# Altium project Контроллер табло изм.2.PrjPcb
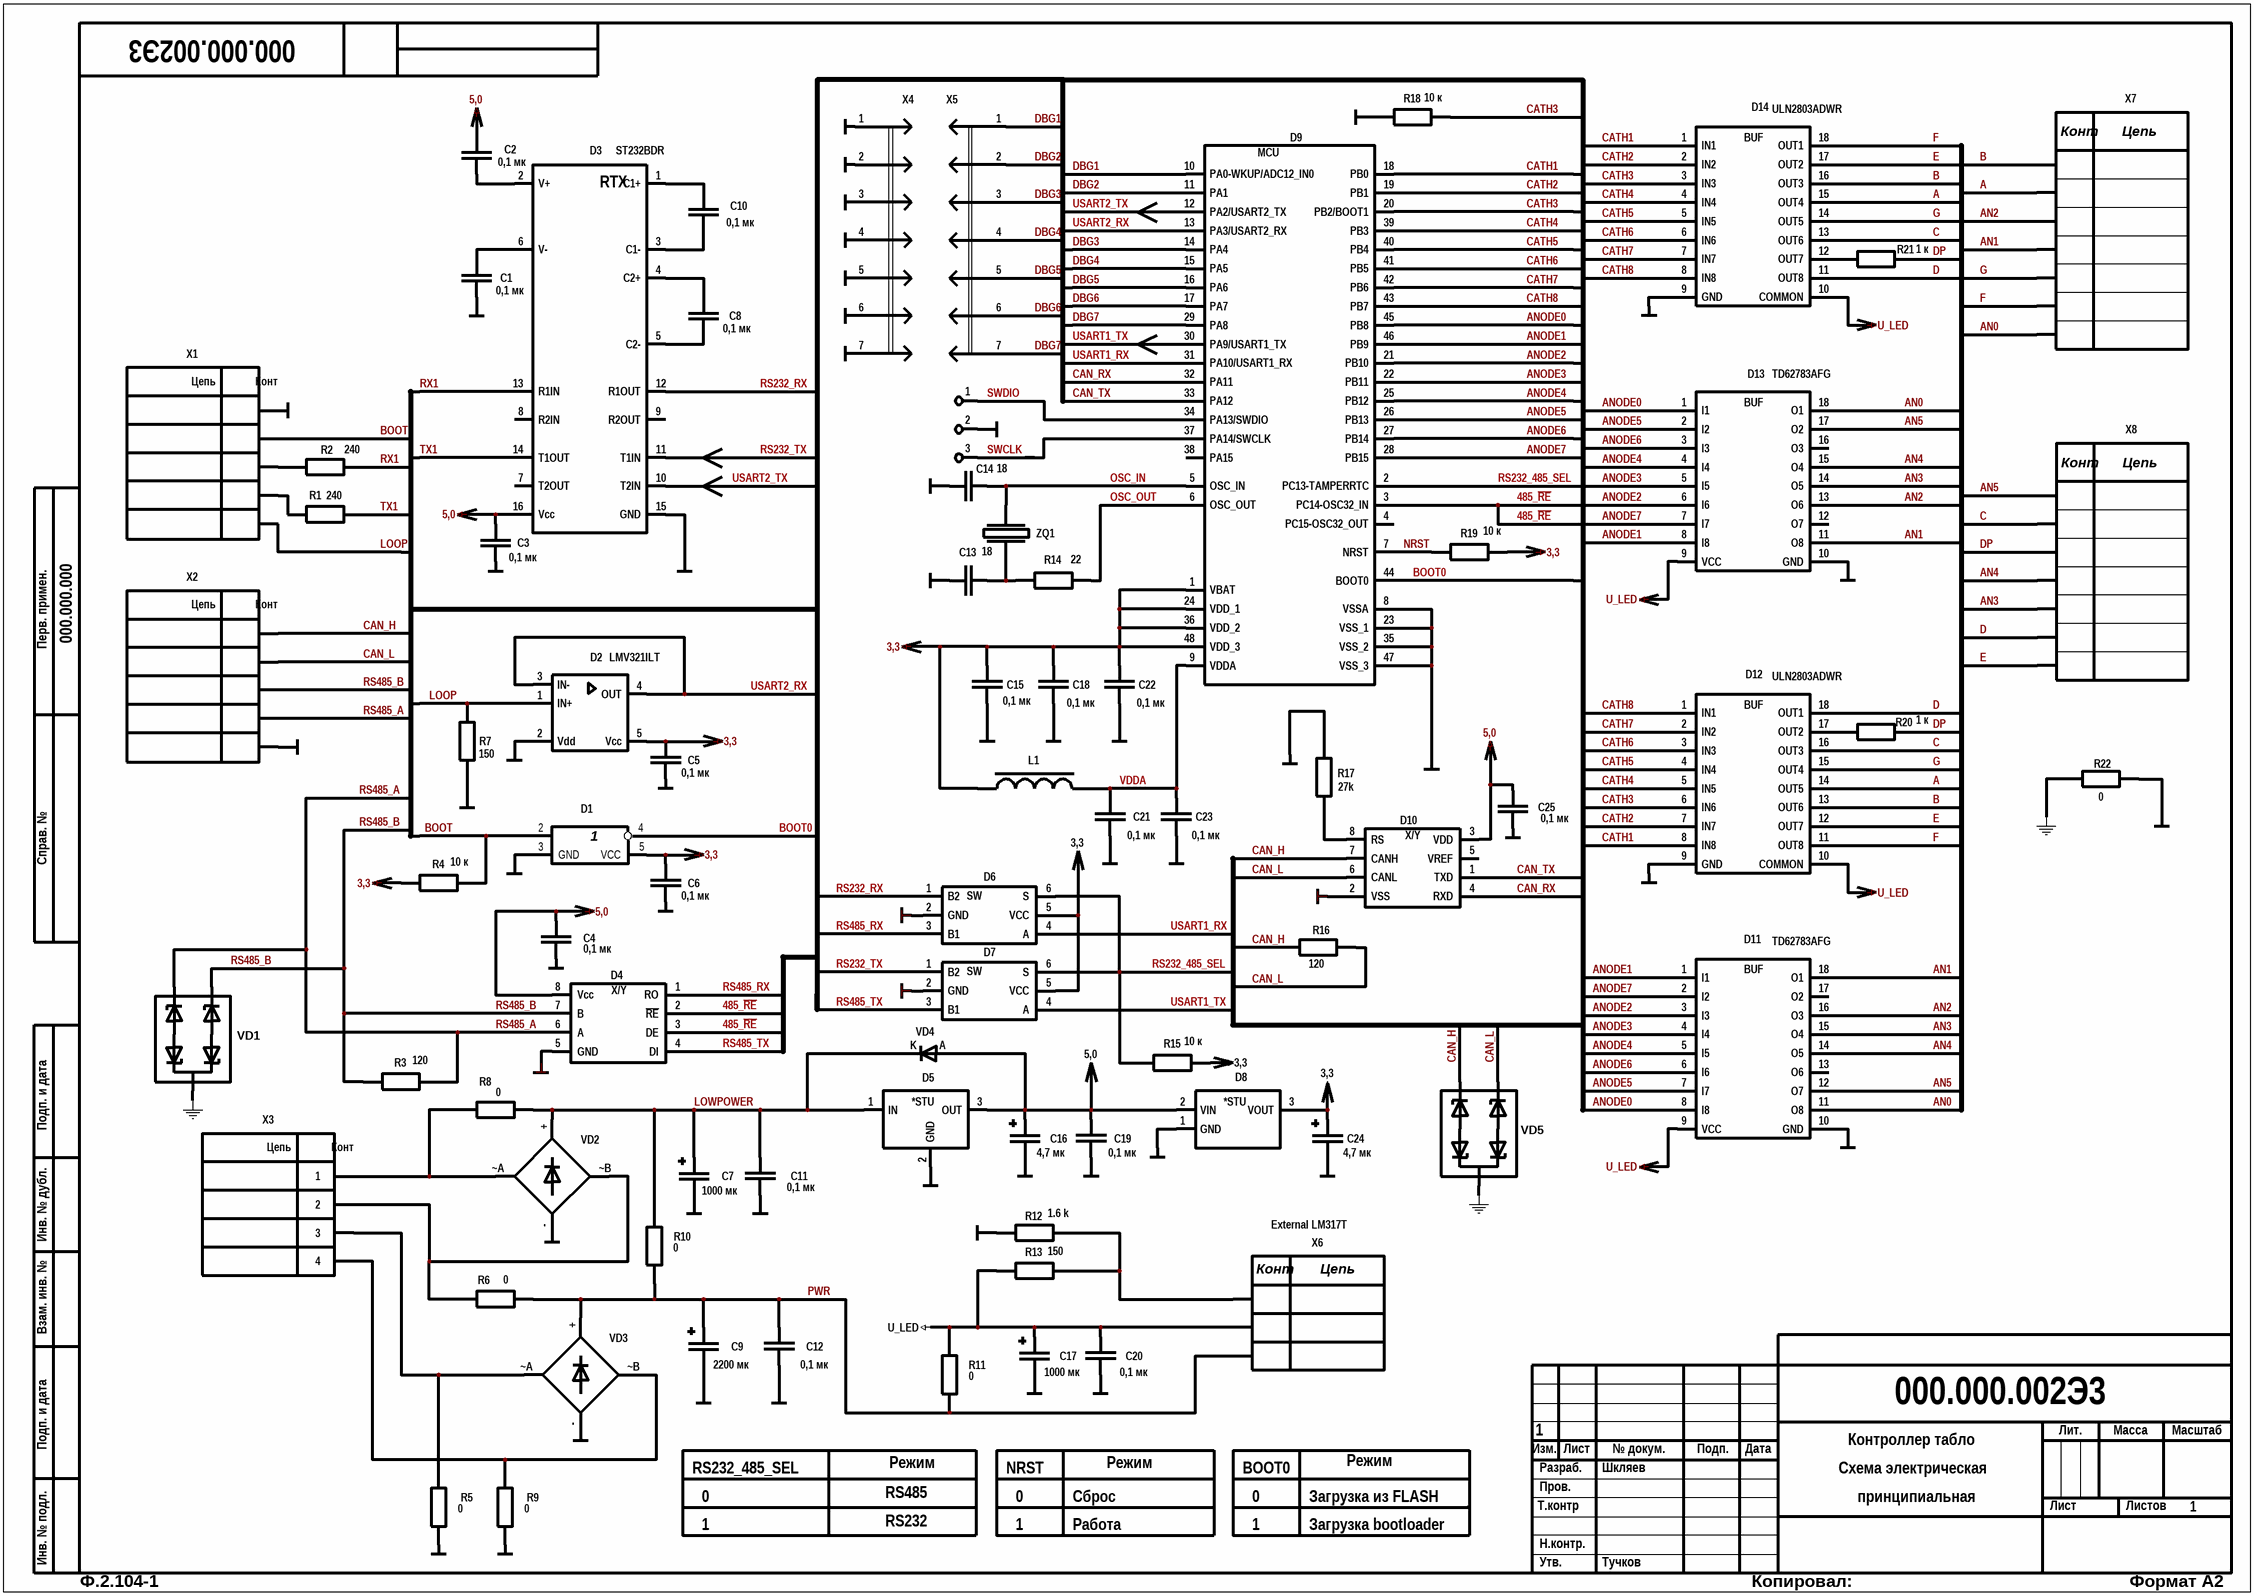
[diagram p0: 000.000.002Э3 Контроллер табло.SchDoc]
1 sheet, 155 parts. Net scope: global (net labels, ports and power ports of the same name join across sheets).
Board file: 000.000.002 rev.1.PcbDoc

## Sheet 000.000.002Э3 Контроллер табло.SchDoc
size 594 x 420 mm; Zam._gl._konstr._po_konctr._chasti: {Фамилия}; Zakaz: {Заказ}; Zam._gl._konstr._po_shemnoi_chasti: {Инженер}; ApprovedBy: Тучков; DrawnBy: Шкляев; DocumentNumber: 000.000.002Э3; SheetTotal: 1; PageSetup: Record=PageOptions|CenterHorizontal=False|CenterVertical=False|PrintScale=0.33|XCorrection=0.00|YCorrection=0.00|PrintKind=1|BorderSize=5000000|LeftOffset=0|BottomOffset=0|Orientation=1|PaperLength=1000|PaperWidth=1000|Scale=100|PaperSource=15|PrintQuality=600|MediaType=1|DitherType=10|PaperKind=A4|PrintScaleMode=1; ImagePath: 000.000.000; Rule: PcbType=ProtelPcb

### Parts
(Parts that share a designator on the sheet are numbered #1, #2 ... from top to bottom, then left to right.)
1  (no value)  [PADROUND]  (no BOM)
2  (no value)  [PADROUND]  (no BOM)
3  (no value)  [PADROUND]  (no BOM)
*  Arrow signal  (value not drawn)  (graphical)
*?#1  (no value)  (graphical)
*?#2  GND  (value not drawn)  (graphical)
*?#3  GND  (value not drawn)  (graphical)
*?#4  GND  (value not drawn)  (graphical)
*?#5  GND  (value not drawn)  (graphical)
*?#6  Arrow signal  (value not drawn)  (graphical)
*?#7  GND  (value not drawn)  (graphical)
*?#8  GND  (value not drawn)  (graphical)
*?#9  GND  (value not drawn)  (graphical)
*?#10  GND  (value not drawn)  (graphical)
*?#11  GND  (value not drawn)  (graphical)
*?#12  (no value)  (graphical)
*?#13  Arrow signal  (value not drawn)  (graphical)
*?#14  GND  (value not drawn)  (graphical)
*?#15  GND  (value not drawn)  (graphical)
*?#16  GND  (value not drawn)  (graphical)
*?#17  Arrow signal  (value not drawn)  (graphical)
*?#18  GND  (value not drawn)  (graphical)
*?#19  (no value)  (graphical)
*?#20  (no value)  (graphical)
*?#21  GND  (value not drawn)  (graphical)
*?#22  GND  (value not drawn)  (graphical)
*?#23  GND  (value not drawn)  (graphical)
*?#24  GND  (value not drawn)  (graphical)
*?#25  (no value)  (graphical)
*?#26  (no value)  (graphical)
*?#27  GND  (value not drawn)  (graphical)
*?#28  GND  (value not drawn)  (graphical)
*?#29  GND  (value not drawn)  (graphical)
*?#30  (no value)  (graphical)
*?#31  (no value)  (graphical)
*?#32  GND  (value not drawn)  (graphical)
*?#33  GND  (value not drawn)  (graphical)
*?#34  GND  (value not drawn)  (graphical)
*?#35  GND  (value not drawn)  (graphical)
*?#36  GND  (value not drawn)  (graphical)
*?#37  GND  (value not drawn)  (graphical)
*?#38  GND  (value not drawn)  (graphical)
*?#39  GND  (value not drawn)  (graphical)
*?#40  (no value)  (graphical)
*?#41  (no value)  (graphical)
*?#42  GND  (value not drawn)  (graphical)
*?#43  GND  (value not drawn)  (graphical)
*?#44  GND  (value not drawn)  (graphical)
*?#45  GND  (value not drawn)  (graphical)
*?#46  (no value)  (graphical)
*?#47  (no value)  (graphical)
*?#48  GND  (value not drawn)  (graphical)
*?#49  GND  (value not drawn)  (graphical)
*?#50  (no value)  (graphical)
*?#51  GND  (value not drawn)  (graphical)
*?#52  GND  (value not drawn)  (graphical)
*?#53  GND  (value not drawn)  (graphical)
*?#54  GND  (value not drawn)  (graphical)
*?#55  (no value)  (graphical)
*?#56  (no value)  (graphical)
*?#57  (no value)  (graphical)
*?#58  GND  (value not drawn)  (graphical)
*?#59  GND  (value not drawn)  (graphical)
*?#60  GND  (value not drawn)  (graphical)
*?#61  GND  (value not drawn)  (graphical)
*?#62  GND  (value not drawn)  (graphical)
*?#63  (no value)  (graphical)
*?#64  GND  (value not drawn)  (graphical)
*?#65  GND  (value not drawn)  (graphical)
*?#66  GND  (value not drawn)  (graphical)
*?#67  GND  (value not drawn)  (graphical)
*?#68  GND  (value not drawn)  (graphical)
*?#69  GND  (value not drawn)  (graphical)
*?#70  GND  (value not drawn)  (graphical)
*?#71  GND  (value not drawn)  (graphical)
*?#72  GND  (value not drawn)  (graphical)
*?#73  GND  (value not drawn)  (graphical)
*?#74  GND  (value not drawn)  (graphical)
*?#75  GND  (value not drawn)  (graphical)
C1  Visible: 0,1 мк  [CAP0805-125]  (hidden comment: GRM21BR71H104KA01L (0805 X7R 0,1 мкФ ±10% 50 В))
C2  Visible: 0,1 мк  [CAP0805-125]  (hidden comment: GRM21BR71H104KA01L (0805 X7R 0,1 мкФ ±10% 50 В))
C3  Visible: 0,1 мк  [CAP0805-125]  (hidden comment: GRM21BR71E105KA99L (0805 X7R 1 мкФ ±10% 25 В))
C4  Visible: 0,1 мк  [CAP0805-125]  (hidden comment: GRM21BR71E105KA99L (0805 X7R 1 мкФ ±10% 25 В))
C5  Visible: 0,1 мк  [CAP0805-125]  (hidden comment: GRM21BR71H104KA01L (0805 X7R 0,1 мкФ ±10% 50 В))
C6  Visible: 0,1 мк  [CAP0805-125]  (hidden comment: GRM21BR71H104KA01L (0805 X7R 0,1 мкФ ±10% 50 В))
C7  Visible: 1000 мк  [CAPR10x21]  (hidden comment: WLR102M1EG21 (1000 мкФ 25 В 10х21))
C8  Visible: 0,1 мк  [CAP0805-125]  (hidden comment: GRM21BR71H104KA01L (0805 X7R 0,1 мкФ ±10% 50 В))
C9  Visible: 2200 мк  [CAPR16x25]  (hidden comment: TKR222M1VK25 (2200 мкФ 35 В 16х25))
C10  Visible: 0,1 мк  [CAP0805-125]  (hidden comment: GRM21BR71H104KA01L (0805 X7R 0,1 мкФ ±10% 50 В))
C11  Visible: 0,1 мк  [JFA11x13x7.5]  (hidden comment: JFA02A104J (0,1 мкФ, 100 В, 5%))
C12  Visible: 0,1 мк  [JFA11x13x7.5]  (hidden comment: JFA02A104J (0,1 мкФ, 100 В, 5%))
C13  Visible: 18  [CAP0805-060_NP0]  (hidden comment: GRM2165C1H180JD01D (0805 NP0 18 пФ ±5% 50 В))
C14  Visible: 18  [CAP0805-060_NP0]  (hidden comment: GRM2165C1H180JD01D (0805 NP0 18 пФ ±5% 50 В))
C15  Visible: 0,1 мк  [CAP0805-125]  (hidden comment: GRM21BR71H104KA01L (0805 X7R 0,1 мкФ ±10% 50 В))
C16  Visible: 4,7 мк  [3216-18]  (hidden comment: TECAP4.7/10VA10 ( тип А 4,7 мкФ 10 В ±10%))
C17  Visible: 1000 мк  [CAPR10x21]  (hidden comment: WLR102M1EG21 (1000 мкФ 25 В 10х21))
C18  Visible: 0,1 мк  [CAP0805-125]  (hidden comment: GRM21BR71H104KA01L (0805 X7R 0,1 мкФ ±10% 50 В))
C19  Visible: 0,1 мк  [CAP0805-125]  (hidden comment: GRM21BR71H104KA01L (0805 X7R 0.1 мкФ ±10% 50 В))
C20  Visible: 0,1 мк  [JFA11x13x7.5]  (hidden comment: JFA02A104J (0,1 мкФ, 100 В, 5%))
C21  Visible: 0,1 мк  [CAP0805-125]  (hidden comment: GRM21BR71E105KA99L (0805 X7R 1 мкФ ±10% 25 В))
C22  Visible: 0,1 мк  [CAP0805-125]  (hidden comment: GRM21BR71H104KA01L (0805 X7R 0,1 мкФ ±10% 50 В))
C23  Visible: 0,1 мк  [CAP0805-125]  (hidden comment: GRM21BR71H104KA01L (0805 X7R 0,1 мкФ ±10% 50 В))
C24  Visible: 4,7 мк  [3216-18]  (hidden comment: TECAP4.7/10VA10 ( тип А 4,7 мкФ 10 В ±10%))
C25  Visible: 0,1 мк  [CAP0805-125]  (hidden comment: GRM21BR71E105KA99L (0805 X7R 1 мкФ ±10% 25 В))
D1  SN74AHC1G14DRLR  [SOT23-5AM]  (value not drawn)
D2  LMV321ILT  [SOT23-5]
D3  ST232BDR  [SO16_N]
D4  ST485ECDR  [SOIC8N_L]  (value not drawn)
D5  L78M05ABDT-TR  [D2PAK]  (value not drawn)
D6  SN74LVC1G3157DBVR  [SOT23-6]  (value not drawn)
D7  SN74LVC1G3157DBVR  [SOT23-6]  (value not drawn)
D8  MC78LC33NTRG  [SOT23-5]  (value not drawn)
D9  STM32F103C8T6  [LQFP-48]  (value not drawn)
D10  MCP2551-I/SN  [SOIC8N_L]  (value not drawn)
D11  TD62783AFG  [SOP-18]
D12  ULN2803ADWR  [SOP-18]
D13  TD62783AFG  [SOP-18]
D14  ULN2803ADWR  [SOP-18]
L1  LQM21PN4R7NGR (0805 4,7 мкГн 0,8 А 288 мОм)  [LQM21-G]  (value not drawn)
R1  Visible: 240  [RES0805-050]  (hidden comment: RC0805FR-07240RL (0805 240 Ом ±1%))
R2  Visible: 240  [RES0805-050]  (hidden comment: RC0805FR-07240RL (0805 240 Ом ±1%))
R3  Visible: 120  [RES0805-050]  (hidden comment: RC0805FR-07120RL (0805 120 Ом ±1%))
R4  Visible: 10 к  [RES0805-050]  (hidden comment: RC0805FR-0710KL (0805 10 кОм ±1%))
R5  Visible: 0  [RES2512-055]  (hidden comment: RC2512FR-070RL (1206 0 Ом))
R6  Visible: 0  [RES2512-055]  (hidden comment: RC2512FR-070RL (1206 0 Ом))
R7  Visible: 150  [RES0805-050]  (hidden comment: RC0805FR-07150RL (0805 150 Ом ±1%))
R8  Visible: 0  [RES2512-055]  (hidden comment: RC2512FR-070RL (1206 0 Ом))
R9  Visible: 0  [RES2512-055]  (hidden comment: RC2512FR-070RL (1206 0 Ом))
R10  Visible: 0  [RES2512-055]  (hidden comment: RC2512FR-070RL (1206 0 Ом))
R11  Visible: 0  [RES2512-055]  (hidden comment: RC2512FR-070RL (1206 0 Ом))
R12  Visible: 1.6 k  [RES0805-050]  (hidden comment: RC0805FR-071K6L (0805 1,6 кОм ±1))
R13  Visible: 150  [RES0805-050]  (hidden comment: RC0805FR-07150RL (0805 150 Ом ±1%))
R14  Visible: 22  [RES0805-050]  (hidden comment: RC0805JR-0722R (0805 22 Ом ±5%))
R15  Visible: 10 к  [RES0805-050]  (hidden comment: RC0805FR-0710KL (0805 10 кОм ±1%))
R16  Visible: 120  [RES0805-050]  (hidden comment: RC0805FR-07120RL (0805 120 Ом ±1%))
R17  Visible: 27k  [RES0805-050]  (hidden comment: RC0805FR-0727KL (0805 27 кОм ±1%))
R18  Visible: 10 к  [RES0805-050]  (hidden comment: RC0805FR-0710KL (0805 10 кОм ±1%))
R19  Visible: 10 к  [RES0805-050]  (hidden comment: RC0805FR-0710KL (0805 10 кОм ±1%))
R20  Visible: 1 к  [RES1206-055]  (hidden comment: RC1206FR-071KL (1206 1 кОм ±1%))
R21  Visible: 1 к  [RES1206-055]  (hidden comment: RC1206FR-071KL (1206 1 кОм ±1%))
R22  Visible: 0  [RES2512-055]  (hidden comment: RC2512FR-070RL (1206 0 Ом))
VD1  CDSOT23-SM712  [SOT23]  (value not drawn)
VD2  2W10G-E4/51  [2W10]  (value not drawn)
VD3  2W10G-E4/51  [2W10]  (value not drawn)
VD4  S1G  [DO-214AA]  (value not drawn)
VD5  PESD2CAN,215  [SOT23]  (value not drawn)
X1  DS1070-5MVV6 (WF-05)  [WF-05]  (value not drawn)
X2  DS1070-5MVV6 (WF-05)  [WF-05]  (value not drawn)
X3  DS1072-4MVT6 (PWL-4)  [PWL-4]  (value not drawn)
X4  Соединитель штыревой PLS-7  [PLS-2.54-7]  (value not drawn)
X5  Соединитель штыревой PLS-7  [PLS-2.54-7]  (value not drawn)
X6  Connector 3  [WF-03]  (value not drawn)
X7  (no value)  [WF-07]
X8  (no value)  [WF-07]
ZQ1  8.000MHzHC-49US  [KX-3H_spacer]  (value not drawn)

### Nets
3,3: C5.2 C6.2 C15.2 C18.2 C22.2 C24.1 D1.5(VCC) D2.5(Vcc) D6.5(VCC) D7.5(VCC) D8.3(VOUT) D9.1(VBAT) D9.24(VDD_1) D9.36(VDD_2) D9.48(VDD_3) L1.1 R4.1 R15.2 R19.2
5,0: C2.2 C3.2 C4.2 C16.1 C19.2 C25.2 D3.16(Vcc) D4.8(Vcc) D5.3(OUT) D8.2(VIN) D10.3(VDD) VD4.A
GND: 2.1 C1.1 C3.1 C4.1 C5.1 C6.1 C7.2 C9.2 C11.1 C12.1 C13.2 C14.2 C15.1 C16.2 C17.2 C18.1 C19.1 C20.1 C21.1 C22.1 C23.1 C24.2 C25.1 D1.3(GND) D2.2(Vdd) D3.15(GND) D4.5(GND) D5.2(GND) D6.2(GND) D7.2(GND) D8.1(GND) D9.8(VSSA) D9.23(VSS_1) D9.35(VSS_2) D9.47(VSS_3) D10.2(VSS) D11.10(GND) D12.9(GND) D13.10(GND) D14.9(GND) R5.1 R7.2 R9.1 R12.1 R17.1 R18.2 R22.1 VD2.- VD3.- X1.1 X2.5 X4.1 X4.2 X4.3 X4.4 X4.5 X4.6 X4.7
GND_E: R22.2 VD1.3 VD5.3
U_LED: C17.1 C20.2 D11.9(VCC) D12.10(COMMON) D13.9(VCC) D14.10(COMMON) R11.2 R13.1 X6.2
485_~{RE}: D4.2(~{RE}) D4.3(DE) D9.3(PC14-OSC32_IN)
A: D12.14(OUT5) D14.15(OUT4) X7.2
AN0: D11.11(O8) D13.18(O1) X7.7
AN1: D11.18(O1) D13.11(O8) X7.4
AN2: D11.16(O3) D13.13(O6) X7.3
AN3: D11.15(O4) D13.14(O5) X8.5
AN4: D11.14(O5) D13.15(O4) X8.4
AN5: D11.12(O7) D13.17(O2) X8.1
ANODE0: D9.45(PB8) D11.8(I8) D13.1(I1)
ANODE1: D9.46(PB9) D11.1(I1) D13.8(I8)
ANODE2: D9.21(PB10) D11.3(I3) D13.6(I6)
ANODE3: D9.22(PB11) D11.4(I4) D13.5(I5)
ANODE4: D9.25(PB12) D11.5(I5) D13.4(I4)
ANODE5: D9.26(PB13) D11.7(I7) D13.2(I2)
ANODE6: D9.27(PB14) D11.6(I6) D13.3(I3)
ANODE7: D9.28(PB15) D11.2(I2) D13.7(I7)
B: D12.13(OUT6) D14.16(OUT3) X7.1
BOOT: D1.2 R4.2 X1.2
BOOT0: D1.4 D9.44(BOOT0)
C: D12.16(OUT3) D14.13(OUT6) X8.2
CAN_H: D10.7(CANH) R16.2 VD5.2 X2.1
CAN_L: D10.6(CANL) R16.1 VD5.1 X2.2
CAN_RX: D9.32(PA11) D10.4(RXD)
CAN_TX: D9.33(PA12) D10.1(TXD)
CATH1: D9.18(PB0) D12.8(IN8) D14.1(IN1)
CATH2: D9.19(PB1) D12.7(IN7) D14.2(IN2)
CATH3: D9.20(PB2/BOOT1) D12.6(IN6) D14.3(IN3) R18.1
CATH4: D9.39(PB3) D12.5(IN5) D14.4(IN4)
CATH5: D9.40(PB4) D12.4(IN4) D14.5(IN5)
CATH6: D9.41(PB5) D12.3(IN3) D14.6(IN6)
CATH7: D9.42(PB6) D12.2(IN2) D14.7(IN7)
CATH8: D9.43(PB7) D12.1(IN1) D14.8(IN8)
D: D12.18(OUT1) D14.11(OUT8) X8.6
DBG1: D9.10(PA0-WKUP/ADC12_IN0) X5.1
DBG2: D9.11(PA1) X5.2
DBG3: D9.14(PA4) X5.3
DBG4: D9.15(PA5) X5.4
DBG5: D9.16(PA6) X5.5
DBG6: D9.17(PA7) X5.6
DBG7: D9.29(PA8) X5.7
DP: R20.2 R21.2 X8.3
E: D12.12(OUT7) D14.17(OUT2) X8.7
F: D12.11(OUT8) D14.18(OUT1) X7.6
G: D12.15(OUT4) D14.14(OUT5) X7.5
LOOP: D2.1(IN+) R7.1 X1.5
LOWPOWER: C7.1 C11.2 D5.1(IN) R8.1 R10.2 VD2.+ VD4.K
NRST: D9.7(NRST) R19.1
OSC_IN: C14.1 D9.5(OSC_IN) ZQ1.1
OSC_OUT: D9.6(OSC_OUT) R14.1
PWR: C9.1 C12.2 R6.1 R10.1 R11.1 VD3.+ X6.3
RS232_485_SEL: D6.6(S) D7.6(S) D9.2(PC13-TAMPERRTC) R15.1
RS232_RX: D3.12(R1OUT) D6.1(B2)
RS232_TX: D3.11(T1IN) D7.1(B2)
RS485_A: D4.6(A) R3.2 VD1.2 X2.4
RS485_B: D4.7(B) R3.1 VD1.1 X2.3
RS485_RX: D4.1(RO) D6.3(B1)
RS485_TX: D4.4(DI) D7.3(B1)
RX1: D3.13(R1IN) R2.2
SWCLK: 3.1 D9.37(PA14/SWCLK)
SWDIO: 1.1 D9.34(PA13/SWDIO)
TX1: D3.14(T1OUT) R1.2
USART1_RX: D6.4(A) D9.31(PA10/USART1_RX)
USART1_TX: D7.4(A) D9.30(PA9/USART1_TX)
USART2_RX: D2.3(IN-) D2.4(OUT) D9.13(PA3/USART2_RX)
USART2_TX: D3.10(T2IN) D9.12(PA2/USART2_TX)
VDDA: C21.2 C23.2 D9.9(VDDA) L1.2
NetC1_2: C1.2 D3.6(V-)
NetC2_1: C2.1 D3.2(V+)
NetC8_1: C8.1 D3.5(C2-)
NetC8_2: C8.2 D3.4(C2+)
NetC10_1: C10.1 D3.3(C1-)
NetC10_2: C10.2 D3.1(C1+)
NetC13_1: C13.1 R14.2 ZQ1.2
NetD10_8: D10.8(RS) R17.2
NetD12_17: D12.17(OUT2) R20.1
NetD14_12: D14.12(OUT7) R21.1
NetR1_1: R1.1 X1.4
NetR2_1: R2.1 X1.3
NetR5_2: R5.2 VD3.~A X3.3
NetR6_2: R6.2 VD2.~B X3.2
NetR8_2: R8.2 VD2.~A X3.1
NetR9_2: R9.2 VD3.~B X3.4
NetR12_2: R12.2 R13.2 X6.1

Not connected (* = marked no-connect by the designer): D3 7(T2OUT) 8(R2IN) 9(R2OUT); D9 4(PC15-OSC32_OUT) 38(PA15); D10 5(VREF); D11 13(O6) 17(O2); D13 12(O7) 16(O3)

### Notes on the sheet
- External LM317T
- Режим
- 1
- Контроллер табло
- RS232_485_SEL
- 0
- RS485
- NRST
- Сброс
- BOOT0
- Загрузка из FLASH
- Схема электрическая
- принципиальная
- RS232
- Работа
- Загрузка bootloader
- Перв. примен.
- Справ. №
- Подп. и дата
- Инв. № дубл.
- Взам. инв. №
- Изм.
- Лист
- № докум.
- Подп.
- Дата
- Лит.
- Масса
- Масштаб
- Т.контр
- Пров.
- Разраб.
- Листов
- Инв. № подл.
- Н.контр.
- Ф.2.104-1
- Утв.
- Копировал:
- Формат А2
- (in symbol Connector 3) Конт; Цепь
- (in symbol Connector 4) Цепь; Конт
- (in symbol Connector 5) Цепь; Конт
- (in symbol Connector_7) Конт; Цепь
- (in symbol LM7805CV) *STU
- (in symbol MC78LC00) *STU
- (in symbol MCP2551-I/SN) X/Y
- (in symbol SN74AHC1G14DRLR) 1
- (in symbol SN74LVC1G3157DBVR) SW
- (in symbol ST232BDR) RTX
- (in symbol ST485ECDR) X/Y
- (in symbol STM32F103C8T6) MCU
- (in symbol ULN2803) BUF
- (in symbol UTC62783) BUF

### Library data of the parts
1-3 = Point
*?#1 *?#12 *?#19 *?#20 *?#25 *?#26 *?#30 *?#31 *?#40 *?#41 *?#46 *?#47 *?#50 *?#55-*?#57 *?#63 = Arrow power
C1-C6 C8 C10-C15 C18-C23 C25 = Capacitor
  C1 C2 C5 C6 C8 C10 C15 C18 C22 C23: Value: GRM21BR71H104KA01L (0805 X7R 0,1 мкФ ±10% 50 В); Cost: 7
  C3 C4 C21 C25: Value: GRM21BR71E105KA99L (0805 X7R 1 мкФ ±10% 25 В); Cost: 7
  C11 C12 C20: Value: JFA02A104J (0,1 мкФ, 100 В, 5%); Cost: 6
  C13 C14: Value: GRM2165C1H180JD01D (0805 NP0 18 пФ ±5% 50 В); Cost: 6
  C19: Value: GRM21BR71H104KA01L (0805 X7R 0.1 мкФ ±10% 50 В); Cost: 7
C7 C9 C16 C17 C24 = CAP_POL
  C7 C17: Value: WLR102M1EG21 (1000 мкФ 25 В 10х21); Cost: 16
  C9: Value: TKR222M1VK25 (2200 мкФ 35 В 16х25); Cost: 40
  C16 C24: Value: TECAP4.7/10VA10 ( тип А 4,7 мкФ 10 В ±10%); Cost: 8
D4 = ST485ECDR: RS485 приемопередатчик; Value: ST485ECDR
D5 = LM7805CV: Value: L78M05ABDT-TR; Cost: 15
D6 D7 = SN74LVC1G3157DBVR: Аналоговый переключатель, двухпозиционный; Value: SN74LVC1G3157DBVR
D8 = MC78LC00: Value: MC78LC33NTRG
D10 = MCP2551-I/SN: CAN приемопередатчик; Value: MCP2551-I/SN
D11 D13 = UTC62783: Value: TD62783AFG; Cost: 47
D12 D14 = ULN2803: Value: ULN2803ADWR; Cost: 55
L1 = L: Value: LQM21PN4R7NGR (0805 4,7 мкГн 0,8 А 288 мОм); Cost: 14; Visible: 4,7 мкГн
R1-R22 = Resistor
  R1 R2: Value: RC0805FR-07240RL (0805 240 Ом ±1%); Cost: 0.9
  R3 R16: Value: RC0805FR-07120RL (0805 120 Ом ±1%); Cost: 0.9
  R4 R15 R18 R19: Value: RC0805FR-0710KL (0805 10 кОм ±1%); Cost: 0.9
  R5 R6 R8-R11 R22: Value: RC2512FR-070RL (1206 0 Ом); Cost: 0,9
  R7 R13: Value: RC0805FR-07150RL (0805 150 Ом ±1%); Cost: 0.9
  R12: Value: RC0805FR-071K6L (0805 1,6 кОм ±1); Cost: 0,9
  R14: Value: RC0805JR-0722R (0805 22 Ом ±5%); Cost: 0.9
  R17: Value: RC0805FR-0727KL (0805 27 кОм ±1%); Cost: 0.9
  R20 R21: Value: RC1206FR-071KL (1206 1 кОм ±1%); Cost: 0.8
VD1 = CDSOT23-SM712: ESD for RS485; Value: CDSOT23-SM712
VD2 VD3 = Diode bridge: Diode; Value: 2W10G-E4/51; Cost: 27
VD4 = Diode: Value: S1G; Cost: 3
VD5 = PESD2CAN,215: Diode zener; Value: PESD2CAN,215
X1 X2 = Connector 5: Value: DS1070-5MVV6 (WF-05); Cost: 6
X3 = Connector 4: Value: DS1072-4MVT6 (PWL-4); Cost: 6; Visible: *
X4 X5 = PLS-7: Value: Соединитель штыревой PLS-7
X6 = Connector 3: Value: DS1070-3MVV6 (WF-03); Cost: 5
X7 X8 = Connector_7: Value: DS1070-7MVV6 (WF-7); Cost: 6
ZQ1 = Quartz: Value: 8.000MHzHC-49US; Cost: 15
D1 = SN74AHC1G14DRLR: Value: SN74AHC1G14DRLR
D2 = LMV321ILT: Value: LMV321ILT; Cost: 14
D3 = ST232BDR: Value: ST232BDR; Cost: 22
D9 = STM32F103C8T6: Value: STM32F103C8T6; Cost: 220

## Assembly variants
Основное исполнение: not fitted D9 D10 R2 R4 R5 R6 R7 R8
для источника пост. тока 24 В исп.-01: not fitted C6 VD2 X5
Для питания пост. током 15 В исп.-02: not fitted C6 D9 D10 VD2 X5